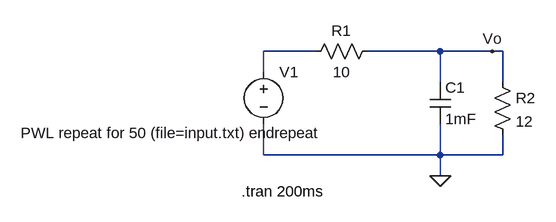
[diagram p0: schematic CET346FinalProject_PWLInput.asc]
CET346FinalProject_PWLInput.asc, the LTspice schematic file:
Version 4
SHEET 1 880 680
WIRE 80 112 0 112
WIRE 272 112 160 112
WIRE 352 112 272 112
WIRE 368 112 352 112
WIRE 0 144 0 112
WIRE 272 160 272 112
WIRE 368 160 368 112
WIRE 0 272 0 224
WIRE 272 272 272 224
WIRE 272 272 0 272
WIRE 368 272 368 240
WIRE 368 272 272 272
WIRE 272 304 272 272
FLAG 272 304 0
FLAG 352 112 Vo
SYMBOL res 176 96 R90
WINDOW 0 0 56 VBottom 2
WINDOW 3 32 56 VTop 2
SYMATTR InstName R1
SYMATTR Value 10
SYMBOL res 352 144 R0
SYMATTR InstName R2
SYMATTR Value 12
SYMBOL cap 256 160 R0
SYMATTR InstName C1
SYMATTR Value 1mF
SYMBOL voltage 0 128 R0
WINDOW 3 -374 110 Left 2
WINDOW 123 0 0 Left 0
WINDOW 39 0 0 Left 0
SYMATTR InstName V1
SYMATTR Value PWL repeat for 50 (file=input.txt) endrepeat
TEXT -34 328 Left 2 !.tran 200ms

The netlist it stands for:
* CET346FinalProject_PWLInput.asc
R1 Vo N001 10
R2 Vo 0 12
C1 Vo 0 1mF
V1 N001 0 PWL repeat for 50 (file=input.txt) endrepeat
.tran 200ms
.backanno
.end